# Altium schematic sheet SolarPanel_PowerGeneration.SchDoc
size 690 x 406 mm; Origin: Eagle
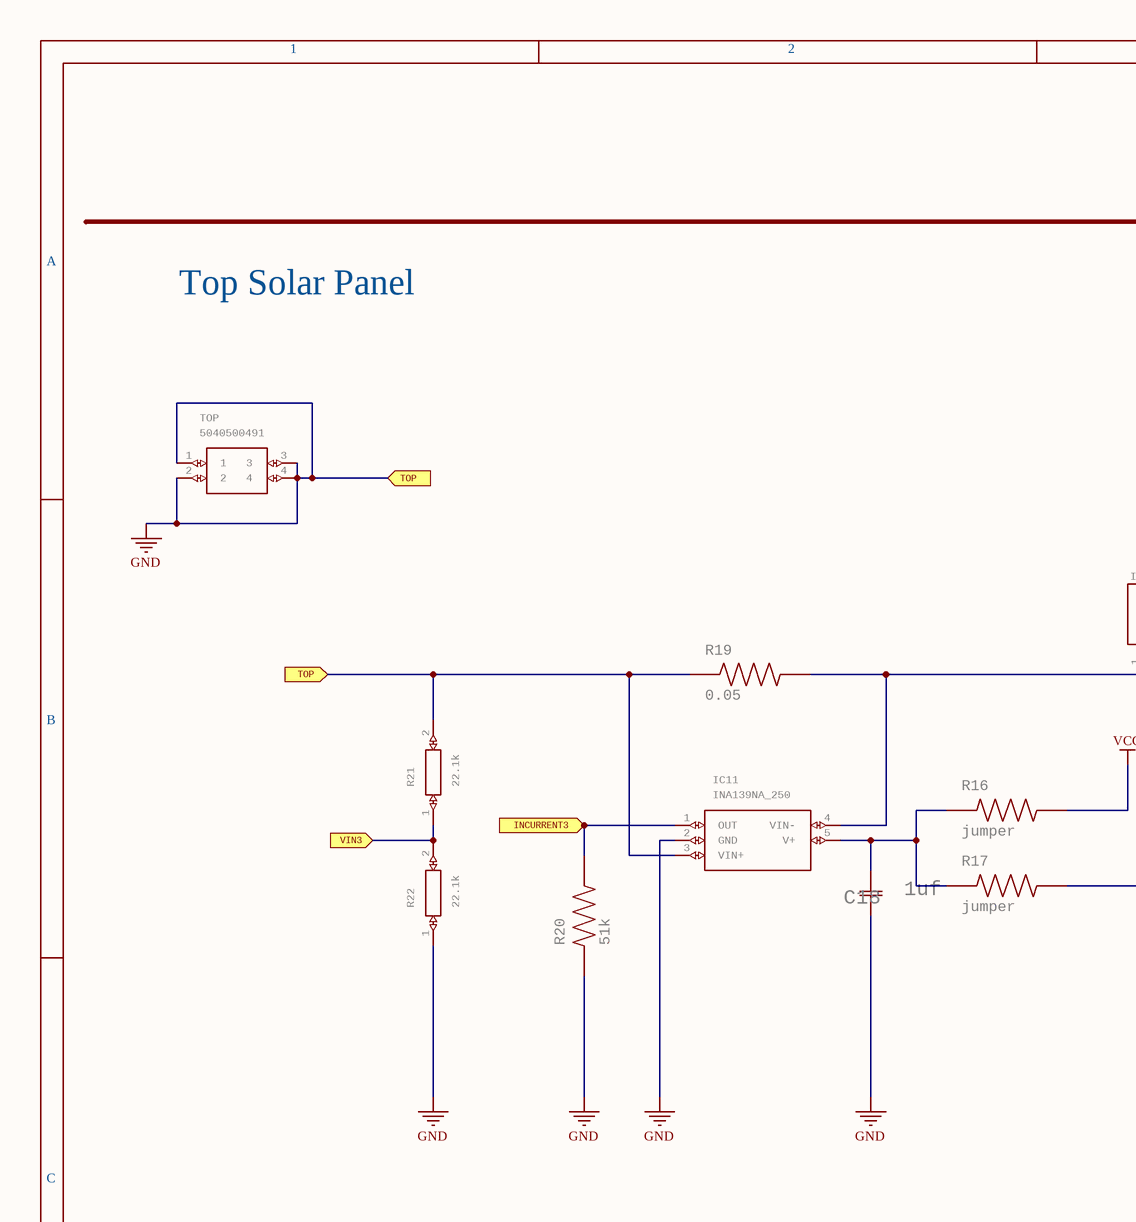
[diagram p0: SolarPanel_PowerGeneration.SchDoc, top left]
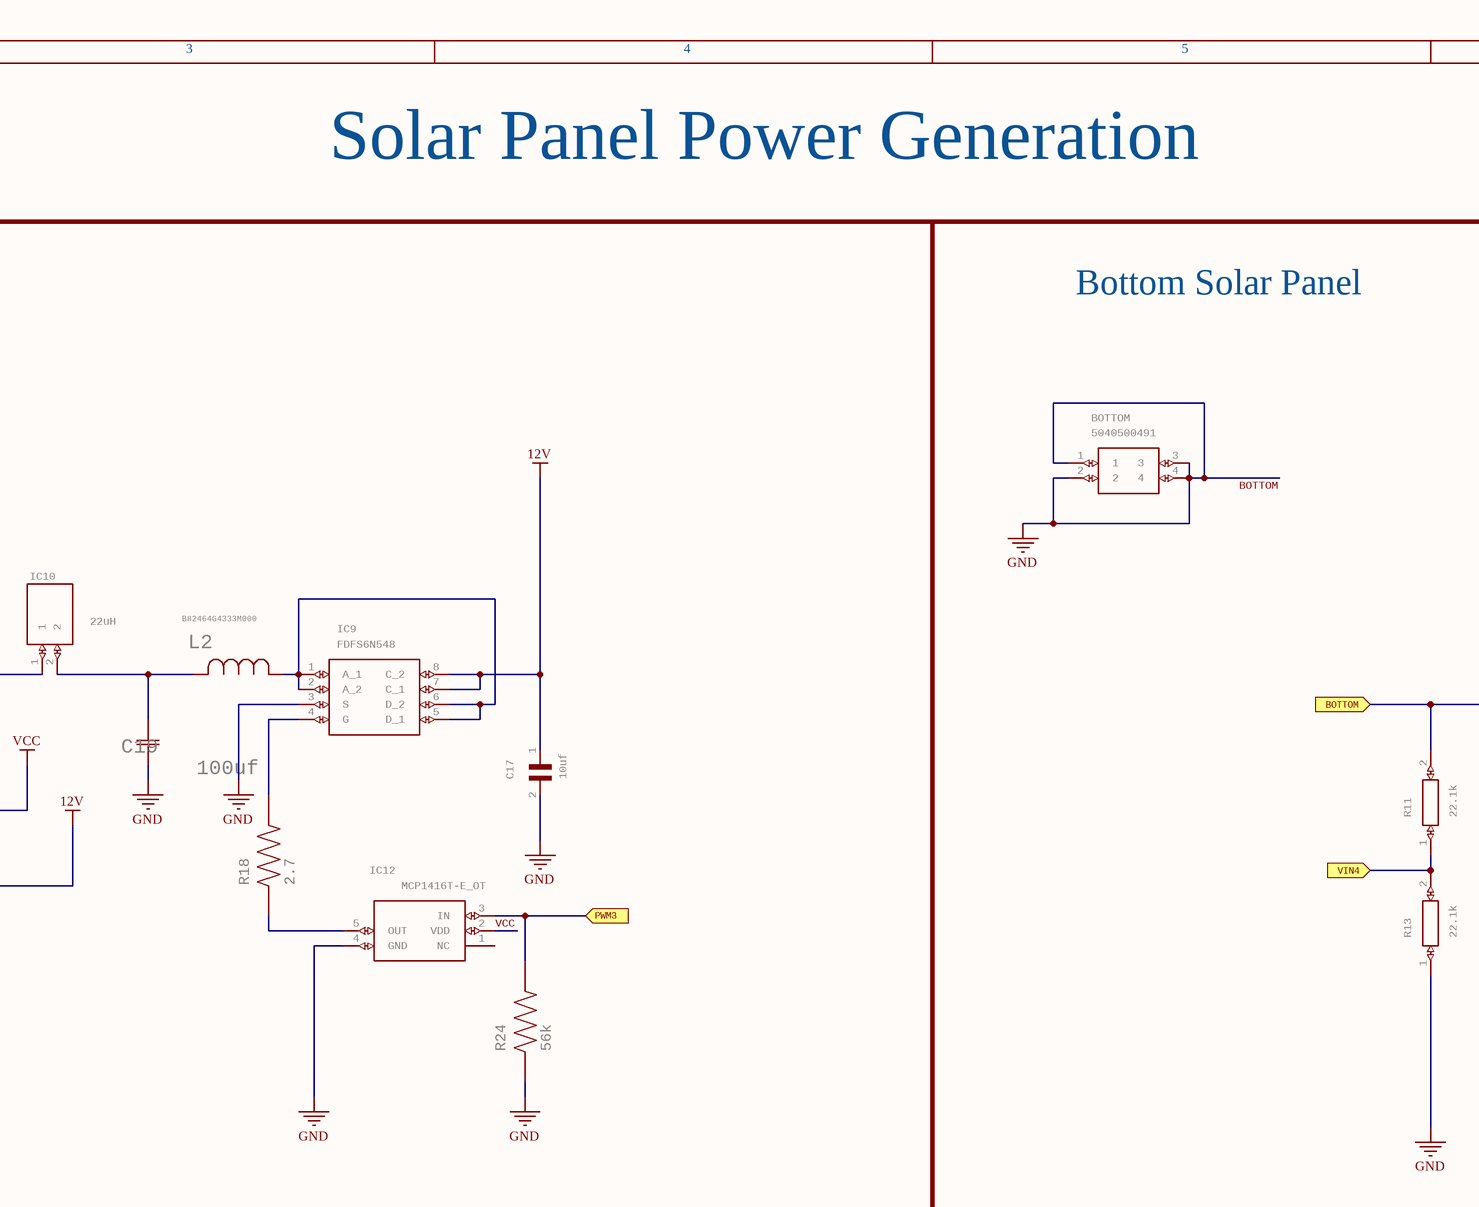
[diagram p1: SolarPanel_PowerGeneration.SchDoc, top middle]
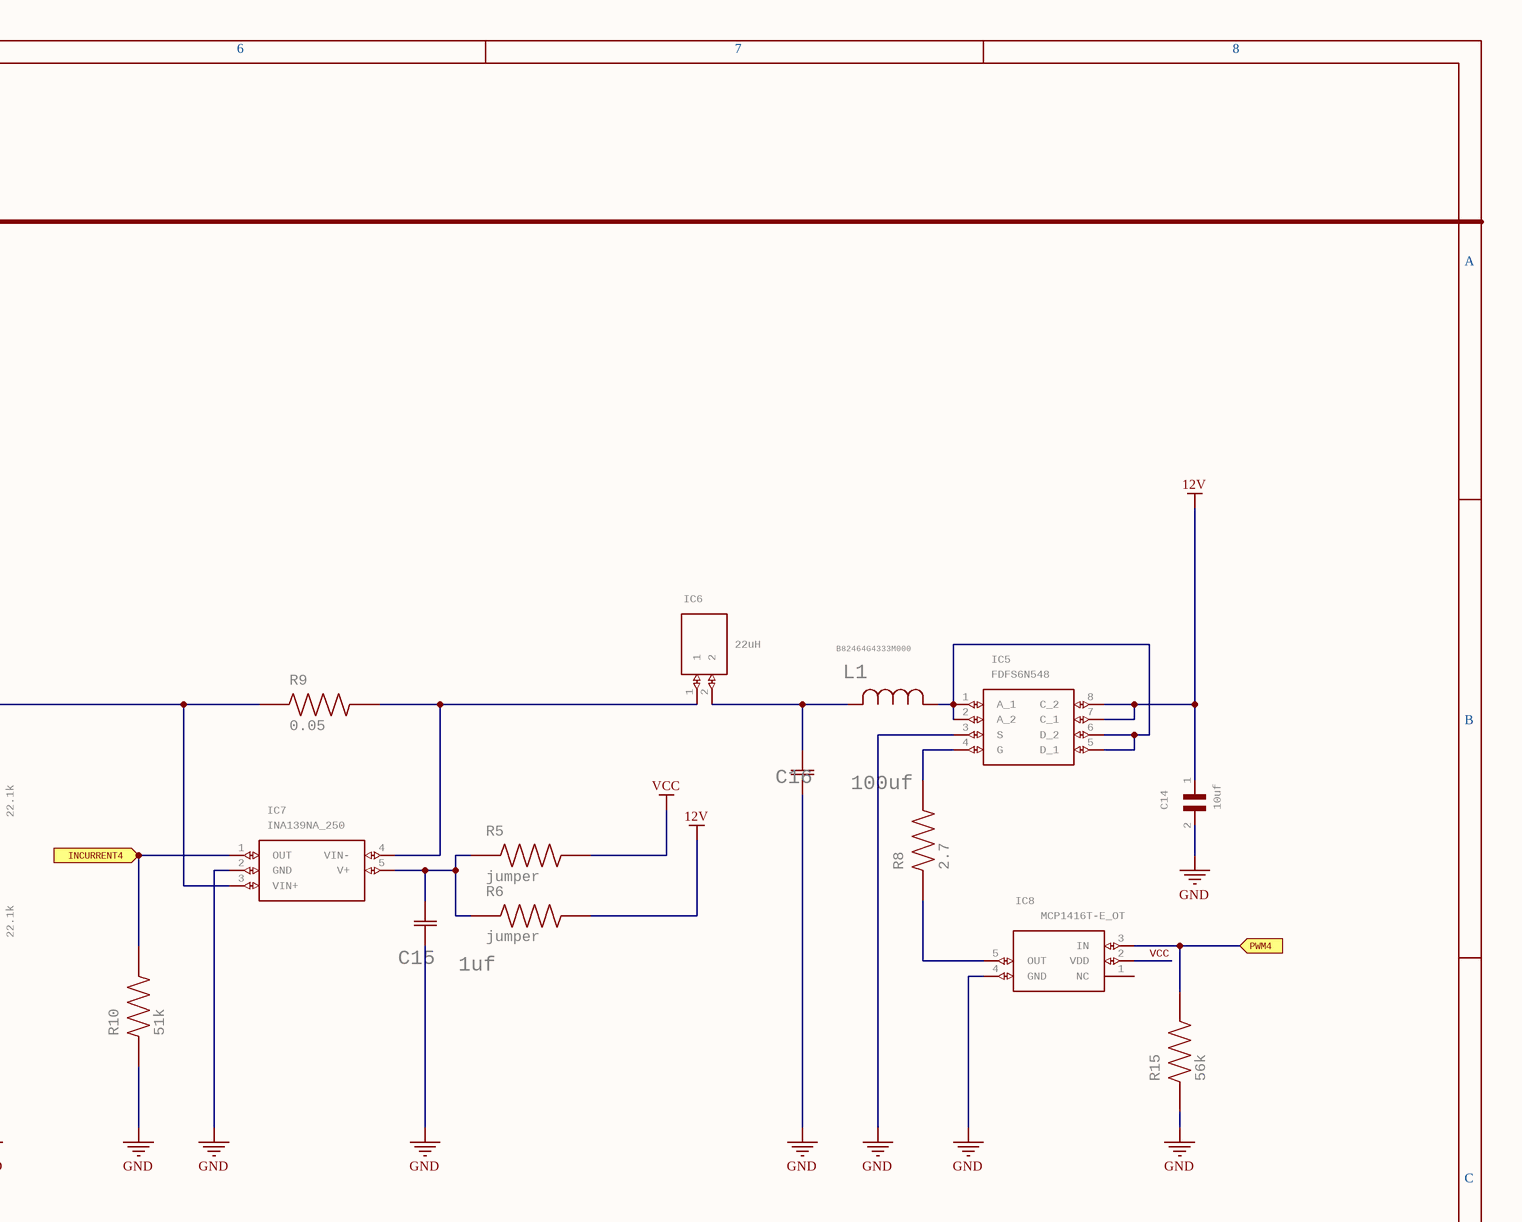
[diagram p2: SolarPanel_PowerGeneration.SchDoc, top right]
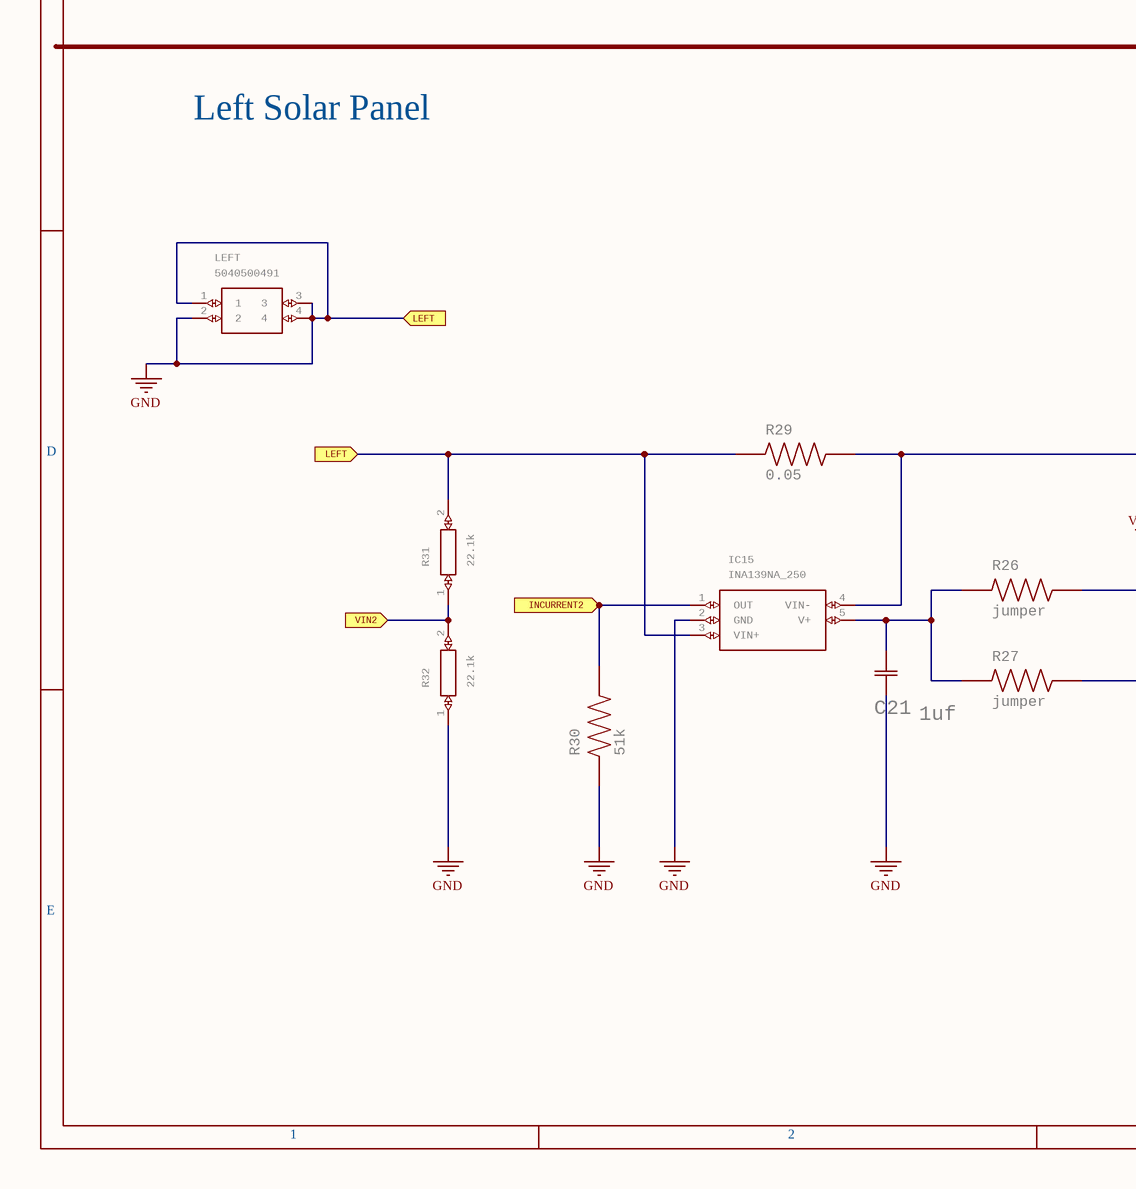
[diagram p3: SolarPanel_PowerGeneration.SchDoc, bottom left]
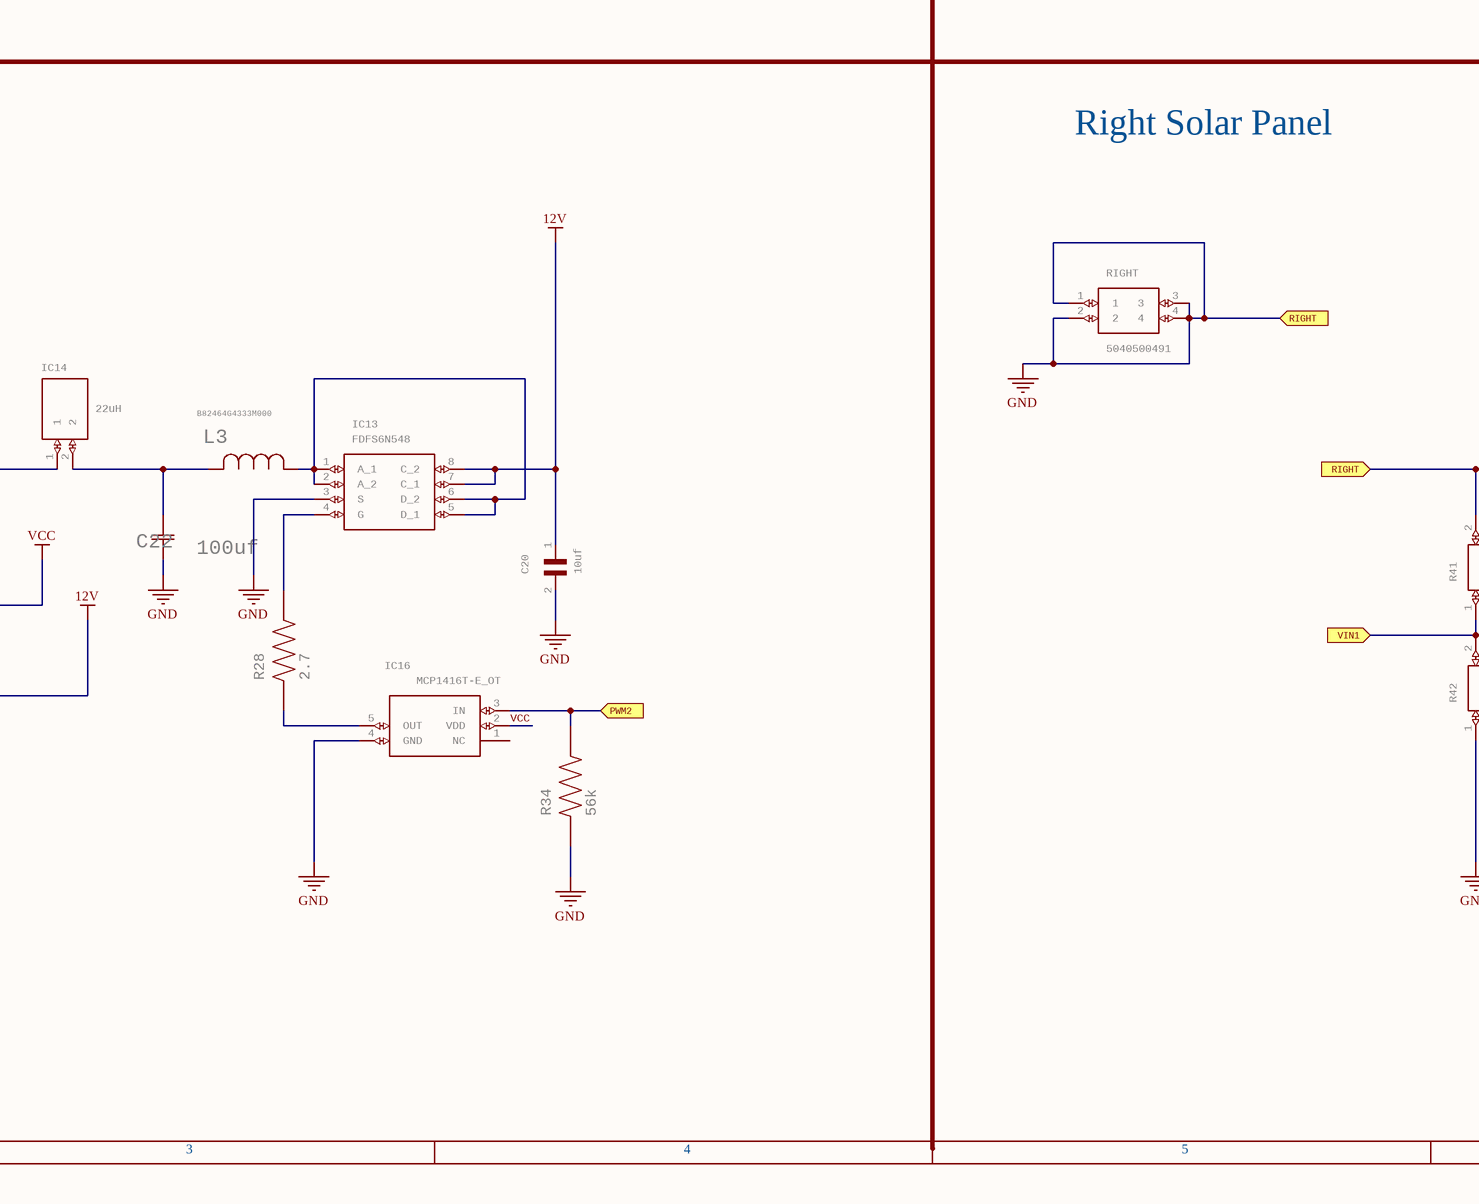
[diagram p4: SolarPanel_PowerGeneration.SchDoc, bottom middle]
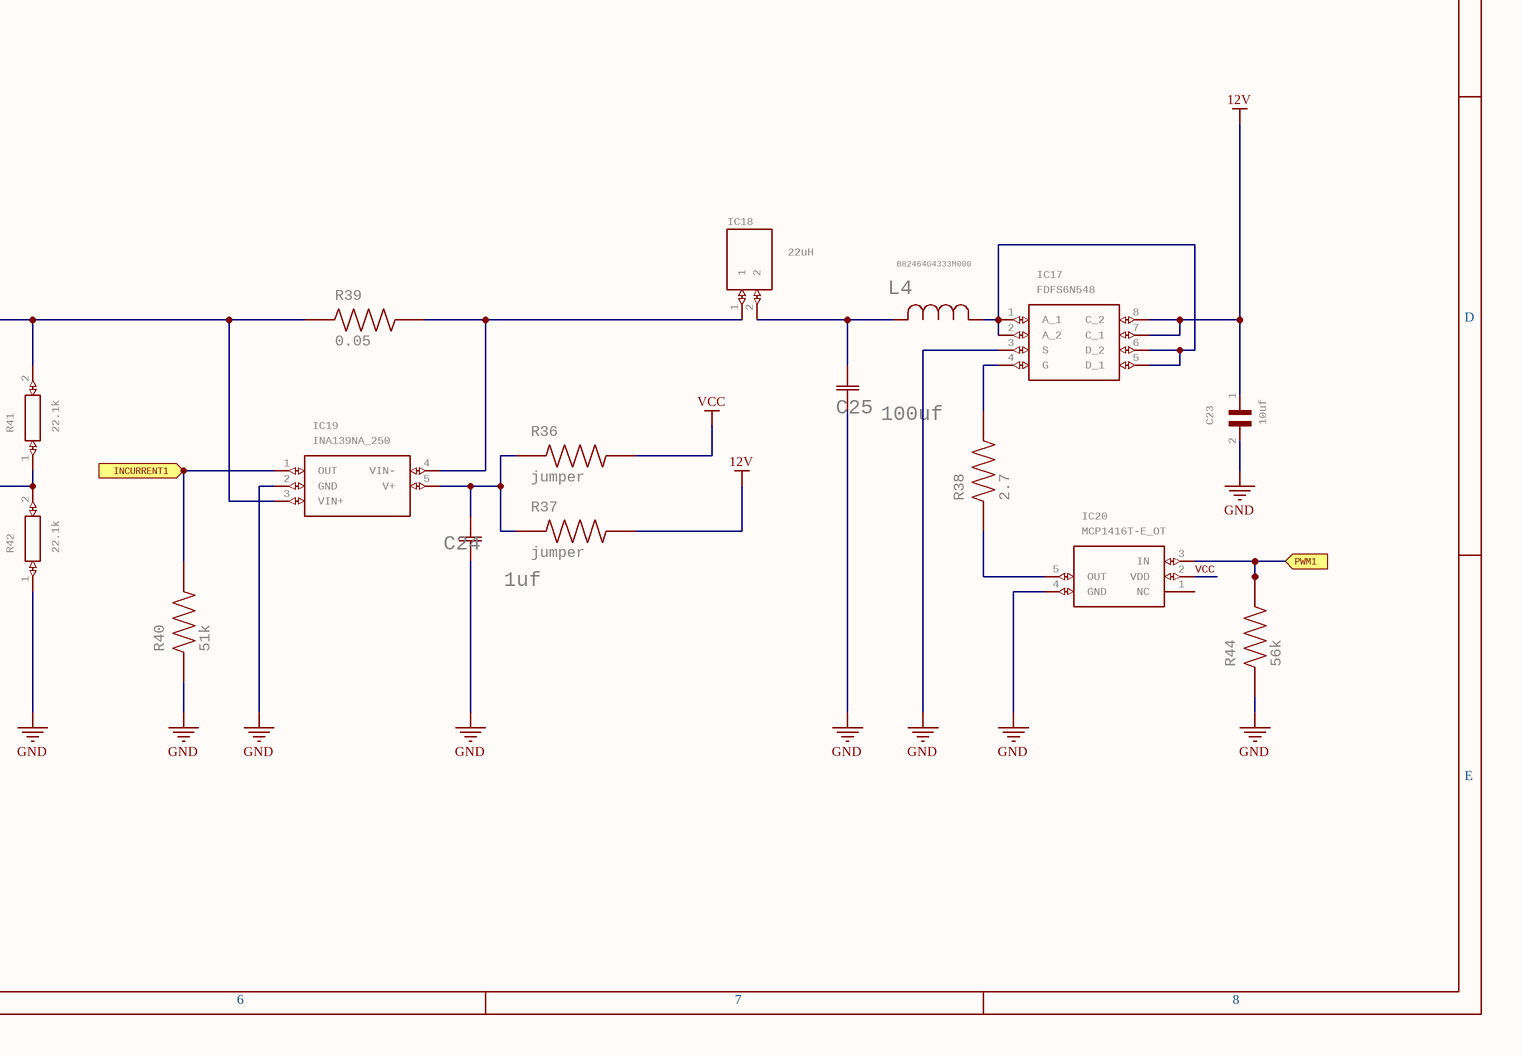
[diagram p5: SolarPanel_PowerGeneration.SchDoc, bottom right]

## Parts
BOTTOM  5040500491  [5040500491]
C14  10uf  [CAPC2012X70]
C15  1uf  [YAG_CC0603_YAG]
C16  100uf  [CAP_CC1210_YAG]
C17  10uf  [CAPC2012X70]
C18  1uf  [YAG_CC0603_YAG]
C19  100uf  [CAP_CC1210_YAG]
C20  10uf  [CAPC2012X70]
C21  1uf  [YAG_CC0603_YAG]
C22  100uf  [CAP_CC1210_YAG]
C23  10uf  [CAPC2012X70]
C24  1uf  [YAG_CC0603_YAG]
C25  100uf  [CAP_CC1210_YAG]
IC5  FDFS6N548  [SOIC127P600X175-8N]
IC6  22uH  [SRU8043220Y]
IC7  INA139NA_250  [SOT95P280X145-5N]
IC8  MCP1416T-E_OT  [SOT95P270X145-5N]
IC9  FDFS6N548  [SOIC127P600X175-8N]
IC10  22uH  [SRU8043220Y]
IC11  INA139NA_250  [SOT95P280X145-5N]
IC12  MCP1416T-E_OT  [SOT95P270X145-5N]
IC13  FDFS6N548  [SOIC127P600X175-8N]
IC14  22uH  [SRU8043220Y]
IC15  INA139NA_250  [SOT95P280X145-5N]
IC16  MCP1416T-E_OT  [SOT95P270X145-5N]
IC17  FDFS6N548  [SOIC127P600X175-8N]
IC18  22uH  [SRU8043220Y]
IC19  INA139NA_250  [SOT95P280X145-5N]
IC20  MCP1416T-E_OT  [SOT95P270X145-5N]
L1  B82464G4333M000  [IND_B82464G4_EPC]
L2  B82464G4333M000  [IND_B82464G4_EPC]
L3  B82464G4333M000  [IND_B82464G4_EPC]
L4  B82464G4333M000  [IND_B82464G4_EPC]
LEFT  5040500491  [5040500491]
R5  jumper  [RESC1508X50N]
R6  jumper  [RESC1508X50N]
R8  2.7  [RESC1608X55N]
R9  0.05  [RESC1608X55N]
R10  51k  [RESC1608X55N]
R11  22.1k  [RESC1608X55N]
R13  22.1k  [RESC1608X55N]
R15  56k  [RESC1608X55N]
R16  jumper  [RESC1508X50N]
R17  jumper  [RESC1508X50N]
R18  2.7  [RESC1608X55N]
R19  0.05  [RESC1608X55N]
R20  51k  [RESC1608X55N]
R21  22.1k  [RESC1608X55N]
R22  22.1k  [RESC1608X55N]
R24  56k  [RESC1608X55N]
R26  jumper  [RESC1508X50N]
R27  jumper  [RESC1508X50N]
R28  2.7  [RESC1608X55N]
R29  0.05  [RESC1608X55N]
R30  51k  [RESC1608X55N]
R31  22.1k  [RESC1608X55N]
R32  22.1k  [RESC1608X55N]
R34  56k  [RESC1608X55N]
R36  jumper  [RESC1508X50N]
R37  jumper  [RESC1508X50N]
R38  2.7  [RESC1608X55N]
R39  0.05  [RESC1608X55N]
R40  51k  [RESC1608X55N]
R41  22.1k  [RESC1608X55N]
R42  22.1k  [RESC1608X55N]
R44  56k  [RESC1608X55N]
RIGHT  5040500491  [5040500491]
TOP  5040500491  [5040500491]

## Ports
BOTTOM (in), INCURRENT1 (in), INCURRENT2 (in), INCURRENT3 (in), INCURRENT4 (in), LEFT (in), PWM1 (in), PWM2 (in), PWM3 (in), PWM4 (in), RIGHT (in), TOP (in), VIN1 (in), VIN2 (in), VIN3 (in), VIN4 (in)

## Nets
12V: C14.1 C17.1 C20.1 C23.1 IC5.7(C_1) IC5.8(C_2) IC9.7(C_1) IC9.8(C_2) IC13.7(C_1) IC13.8(C_2) IC17.7(C_1) IC17.8(C_2) R6.2 R17.2 R27.2 R37.2
BOTTOM: BOTTOM.1 BOTTOM.2 BOTTOM.3 BOTTOM.4 C14.2 C15.1 C16.1 C17.2 C18.1 C19.1 C20.2 C21.1 C22.1 C23.2 C24.1 C25.1 IC5.3(S) IC7.2(GND) IC8.4(GND) IC9.3(S) IC11.2(GND) IC11.3(VIN+) IC12.4(GND) IC13.3(S) IC15.2(GND) IC15.3(VIN+) IC16.4(GND) IC17.3(S) IC19.2(GND) IC19.3(VIN+) IC20.4(GND) LEFT.1 LEFT.2 LEFT.3 LEFT.4 R10.1 R13.1 R15.1 R19.1 R20.1 R21.2 R22.1 R24.1 R29.1 R30.1 R31.2 R32.1 R34.1 R39.1 R40.1 R41.2 R42.1 R44.1 RIGHT.1 RIGHT.2 RIGHT.3 RIGHT.4 TOP.1 TOP.2 TOP.3 TOP.4 ; port LEFT, port RIGHT, port TOP  [also labelled GND]
VCC: IC8.2(VDD) IC12.2(VDD) IC16.2(VDD) IC20.2(VDD) R5.2 R16.2 R26.2 R36.2
BOTTOM: IC7.3(VIN+) R9.1 R11.2 ; port BOTTOM  [a separate net that carries the same name]
INCURRENT1: IC19.1(OUT) R40.2 ; port INCURRENT1
INCURRENT2: IC15.1(OUT) R30.2 ; port INCURRENT2
INCURRENT3: IC11.1(OUT) R20.2 ; port INCURRENT3
INCURRENT4: IC7.1(OUT) R10.2 ; port INCURRENT4
PWM1: IC20.3(IN) R44.2 ; port PWM1
PWM2: IC16.3(IN) R34.2 ; port PWM2
PWM3: IC12.3(IN) R24.2 ; port PWM3
PWM4: IC8.3(IN) R15.2 ; port PWM4
VIN1: R41.1 R42.2 ; port VIN1
VIN2: R31.1 R32.2 ; port VIN2
VIN3: R21.1 R22.2 ; port VIN3
VIN4: R11.1 R13.2 ; port VIN4
NetC15_2: C15.2 IC7.5(V+) R5.1 R6.1
NetC16_2: C16.2 IC6.2 L1.2
NetC18_2: C18.2 IC11.5(V+) R16.1 R17.1
NetC19_2: C19.2 IC10.2 L2.2
NetC21_2: C21.2 IC15.5(V+) R26.1 R27.1
NetC22_2: C22.2 IC14.2 L3.2
NetC24_2: C24.2 IC19.5(V+) R36.1 R37.1
NetC25_2: C25.2 IC18.2 L4.2
NetIC5_1: IC5.1(A_1) IC5.2(A_2) IC5.5(D_1) IC5.6(D_2) L1.1
NetIC5_4: IC5.4(G) R8.2
NetIC6_1: IC6.1 IC7.4(VIN-) R9.2
NetIC8_5: IC8.5(OUT) R8.1
NetIC9_1: IC9.1(A_1) IC9.2(A_2) IC9.5(D_1) IC9.6(D_2) L2.1
NetIC9_4: IC9.4(G) R18.2
NetIC10_1: IC10.1 IC11.4(VIN-) R19.2
NetIC12_5: IC12.5(OUT) R18.1
NetIC13_1: IC13.1(A_1) IC13.2(A_2) IC13.5(D_1) IC13.6(D_2) L3.1
NetIC13_4: IC13.4(G) R28.2
NetIC14_1: IC14.1 IC15.4(VIN-) R29.2
NetIC16_5: IC16.5(OUT) R28.1
NetIC17_1: IC17.1(A_1) IC17.2(A_2) IC17.5(D_1) IC17.6(D_2) L4.1
NetIC17_4: IC17.4(G) R38.2
NetIC18_1: IC18.1 IC19.4(VIN-) R39.2
NetIC20_5: IC20.5(OUT) R38.1

Not connected (* = marked no-connect by the designer): IC8 1(NC); IC12 1(NC); IC16 1(NC); IC20 1(NC)

## Notes on the sheet
- 1
- 2
- 3
- 4
- 5
- 6
- 7
- 8
- Solar Panel Power Generation
- A
- Top Solar Panel
- Bottom Solar Panel
- B
- C
- Left Solar Panel
- Right Solar Panel
- D
- E

## Library data of the parts
BOTTOM LEFT RIGHT TOP = 5040500491: 1.50mm Pitch, Pico-Lock PCB Header, Single Row, Right-Angle, Surface Mount, Gold (Au) Plating, Positive Lock, 4 Circuits, Tape and Reel   Source:  Datasheet; MANUFACTURER_NAME: Molex; GateName_1: G$1; SymbolName_1: 5040500491; LibraryName: Molex Picolock 4pos; DeviceSetName: 5040500491; ARROW_PART_NUMBER: 5040500491; ARROW_PRICE-STOCK: https://www.arrow.com/en/products/5040500491/molex; HEIGHT: 2mm; MANUFACTURER_PART_NUMBER: 5040500491; MOUSER_PART_NUMBER: MOUSER_PART_NUMBER; MOUSER_PRICE-STOCK: MOUSER_PRICE-STOCK
C14 C17 C20 C23 = CC0805KKX5R7BB106: KC 10ÂµF 0805 10% 16V X5R; GateName_1: G$1; MF: Yageo; SymbolName_1: CC0805KKX5R7BB106; LibraryName: Cap 10uf; DeviceSetName: CC0805KKX5R7BB106; DIGI-KEY_PART_NUMBER: 311-1865-1-ND; MP: CC0805KKX5R7BB106; PACKAGE: 0805 Yageo
C15 C18 C21 C24 = CC0603KRX7R7BB105: GateName_1: A; SymbolName_1: CAPH; BUILT_BY: EMA_UL_Team; SOURCELIBRARY: Yageo_2014-12-31; VENDOR: Yageo; LibraryName: Cap 1uf; DeviceSetName: CC0603KRX7R7BB105; MANUFACTURER_PART_NUMBER: CC0603KRX7R7BB105
C16 C19 C22 C25 = CC1210MKX5R5BB107: GateName_1: A; SymbolName_1: CAPH; BUILT_BY: EMA_Justin; SOURCELIBRARY: Add_to_database_2021-05-13; VENDOR: Yageo; LibraryName: Cap 100uf 6.3v; DeviceSetName: CC1210MKX5R5BB107; COPYRIGHT: Copyright (C) 2018 Accelerated Designs. All rights reserved; DATASHEET: https://www.mouser.com/datasheet/2/447/UPY_GP_NP0_16V_to_50V_18-1730511.pdf; MANUFACTURER_PART_NUMBER: CC1210MKX5R5BB107
IC5 IC9 IC13 IC17 = FDFS6N548: MOSFET N-Channel 30V 7A +Schottky SOIC8 Fairchild FDFS6N548 N-channel MOSFET Transistor, 7 A, 30 V, 8-Pin SO   Source:  Datasheet; MANUFACTURER_NAME: ON Semiconductor; GateName_1: G$1; SymbolName_1: FDFS6N548; LibraryName: FDFS6N548; DeviceSetName: FDFS6N548; ARROW_PART_NUMBER: FDFS6N548; ARROW_PRICE-STOCK: https://www.arrow.com/en/products/fdfs6n548/on-semiconductor; HEIGHT: 1.75mm; MANUFACTURER_PART_NUMBER: FDFS6N548; MOUSER_PART_NUMBER: 512-FDFS6N548; MOUSER_PRICE-STOCK: https://www.mouser.co.uk/ProductDetail/ON-Semiconductor-Fairchild/FDFS6N548?qs=b4rH2LiNnwlqgZ%2FZIEc2ow%3D%3D
IC6 IC10 IC14 IC18 = SRU8043-220Y: Bourns SRU6043 Series Shielded Wire-wound SMD Inductor with a Ferrite Core, 22 uH +/-30% Wire-Wound Q:24   Source:  Datasheet; GateName_1: G$1; SymbolName_1: SRU8043-220Y; LibraryName: SRU8043-220Y; DeviceSetName: SRU8043-220Y; ARROW_PART_NUMBER: SRU8043-220Y; ARROW_PRICE-STOCK: https://www.arrow.com/en/products/sru8043-220y/bourns; HEIGHT: 4.6mm; MANUFACTURER_NAME: Bourns; MANUFACTURER_PART_NUMBER: SRU8043-220Y; MOUSER_PART_NUMBER: 652-SRU8043-220Y; MOUSER_PRICE-STOCK: https://www.mouser.co.uk/ProductDetail/Bourns/SRU8043-220Y?qs=3fQS%252B%2FKBkgzsqu9QDdXSwQ%3D%3D
IC7 IC11 IC15 IC19 = INA139NA_250: 36V, High-Side, High-Speed, Current Output Current Sense Amplifier   Source:  Datasheet; MANUFACTURER_NAME: Texas Instruments; MANUFACTURER_PART_NUMBER: INA139NA/250; GateName_1: G$1; SymbolName_1: INA139NA_250; LibraryName: INA139NA_250; DeviceSetName: INA139NA_250; ARROW_PART_NUMBER: INA139NA/250; ARROW_PRICE-STOCK: https://www.arrow.com/en/products/ina139na250/texas-instruments; HEIGHT: 1.45mm; MOUSER_PART_NUMBER: 595-INA139NA/250; MOUSER_PRICE-STOCK: https://www.mouser.co.uk/ProductDetail/Texas-Instruments/INA139NA-250?qs=VBduBm9rCJQSYOixXF05Zw%3D%3D
IC8 IC12 IC16 IC20 = MCP1416T-E_OT: MOSFET Driver 1.5A High-Speed 18V SOT23   Source:  Datasheet; MANUFACTURER_NAME: Microchip; MANUFACTURER_PART_NUMBER: MCP1416T-E/OT; GateName_1: G$1; SymbolName_1: MCP1416T-E_OT; LibraryName: MCP1416T-E_OT; DeviceSetName: MCP1416T-E_OT; ARROW_PART_NUMBER: MCP1416T-E/OT; ARROW_PRICE-STOCK: https://www.arrow.com/en/products/mcp1416t-eot/microchip-technology; HEIGHT: 1.45mm; MOUSER_PART_NUMBER: 579-MCP1416T-E/OT; MOUSER_PRICE-STOCK: https://www.mouser.co.uk/ProductDetail/Microchip-Technology/MCP1416T-E-OT?qs=hH%252BOa0VZEiBT%252BgAjATFU6A%3D%3D
L1-L4 = B82464G4333M000: GateName_1: A; SymbolName_1: IND; BUILT_BY: EMA_UL_Team; SOURCELIBRARY: Epcos_2010-01-01_IND_B82464G4; VENDOR: Epcos; LibraryName: B82464G4333M; DeviceSetName: B82464G4333M000; MANUFACTURER_PART_NUMBER: B82464G4333M000
R5 R6 R16 R17 R26 R27 R36 R37 = CRCW06030000ZSTB: RES SMD 0 OHM JUMPER 1/10W 0603; GateName_1: G$1; MF: Vishay Dale; SymbolName_1: CRCW06030000ZSTB; LibraryName: Jumper; DeviceSetName: CRCW06030000ZSTB; DIGI-KEY_PART_NUMBER: DIGI-KEY_PART_NUMBER; MP: CRCW06030000ZSTB; PACKAGE: 1508 Vishay
R8 R18 R28 R38 = RL0816S-2R7-F: GateName_1: G$1; MF: Susumu; SymbolName_1: RL0816S-2R7-F; LibraryName: Res1-2.7; DeviceSetName: RL0816S-2R7-F; DIGI-KEY_PART_NUMBER: DIGI-KEY_PART_NUMBER; MP: RL0816S-2R7-F; PACKAGE: 1608 Susumu
R9 R19 R29 R39 = ERJ-L03KJ50MV: RES SMD 0.05 OHM 5% 1/5W 0603; GateName_1: G$1; MF: Panasonic; SymbolName_1: ERJ-L03KJ50MV; LibraryName: Res1 0.05; DeviceSetName: ERJ-L03KJ50MV; DIGI-KEY_PART_NUMBER: P50NJCT-ND; MP: ERJ-L03KJ50MV; PACKAGE: 1608-2 Panasonic
R10 R20 R30 R40 = ERJ-PB3D5102V: RES SMD 51K OHM 0.5% 1/5W 0603; GateName_1: G$1; MF: Panasonic; SymbolName_1: ERJ-PB3D5102V; LibraryName: Res1 51k; DeviceSetName: ERJ-PB3D5102V; DIGI-KEY_PART_NUMBER: DIGI-KEY_PART_NUMBER; MP: ERJ-PB3D5102V; PACKAGE: 1608 Panasonic Electronic Components
R11 R13 R21 R22 R31 R32 R41 R42 = ERJPB3D2212V: hj   Source:  Datasheet; MANUFACTURER_NAME: Panasonic; GateName_1: G$1; SymbolName_1: ERJPB3D2212V; LibraryName: Res1-22.1k; DeviceSetName: ERJPB3D2212V; ARROW_PART_NUMBER: ARROW_PART_NUMBER; ARROW_PRICE-STOCK: ARROW_PRICE-STOCK; HEIGHT: 0.55mm; MANUFACTURER_PART_NUMBER: ERJPB3D2212V; MOUSER_PART_NUMBER: MOUSER_PART_NUMBER; MOUSER_PRICE-STOCK: MOUSER_PRICE-STOCK
R15 R24 R34 R44 = ERJ-PB3D5602V: RES SMD 56K OHM 0.5% 1/5W 0603; GateName_1: G$1; MF: Panasonic; SymbolName_1: ERJ-PB3D5602V; LibraryName: Res1 56k; DeviceSetName: ERJ-PB3D5602V; DIGI-KEY_PART_NUMBER: DIGI-KEY_PART_NUMBER; MP: ERJ-PB3D5602V; PACKAGE: 1608 Panasonic Electronic Components